# EAGLE design mastercontroller (EAGLE 5.10)
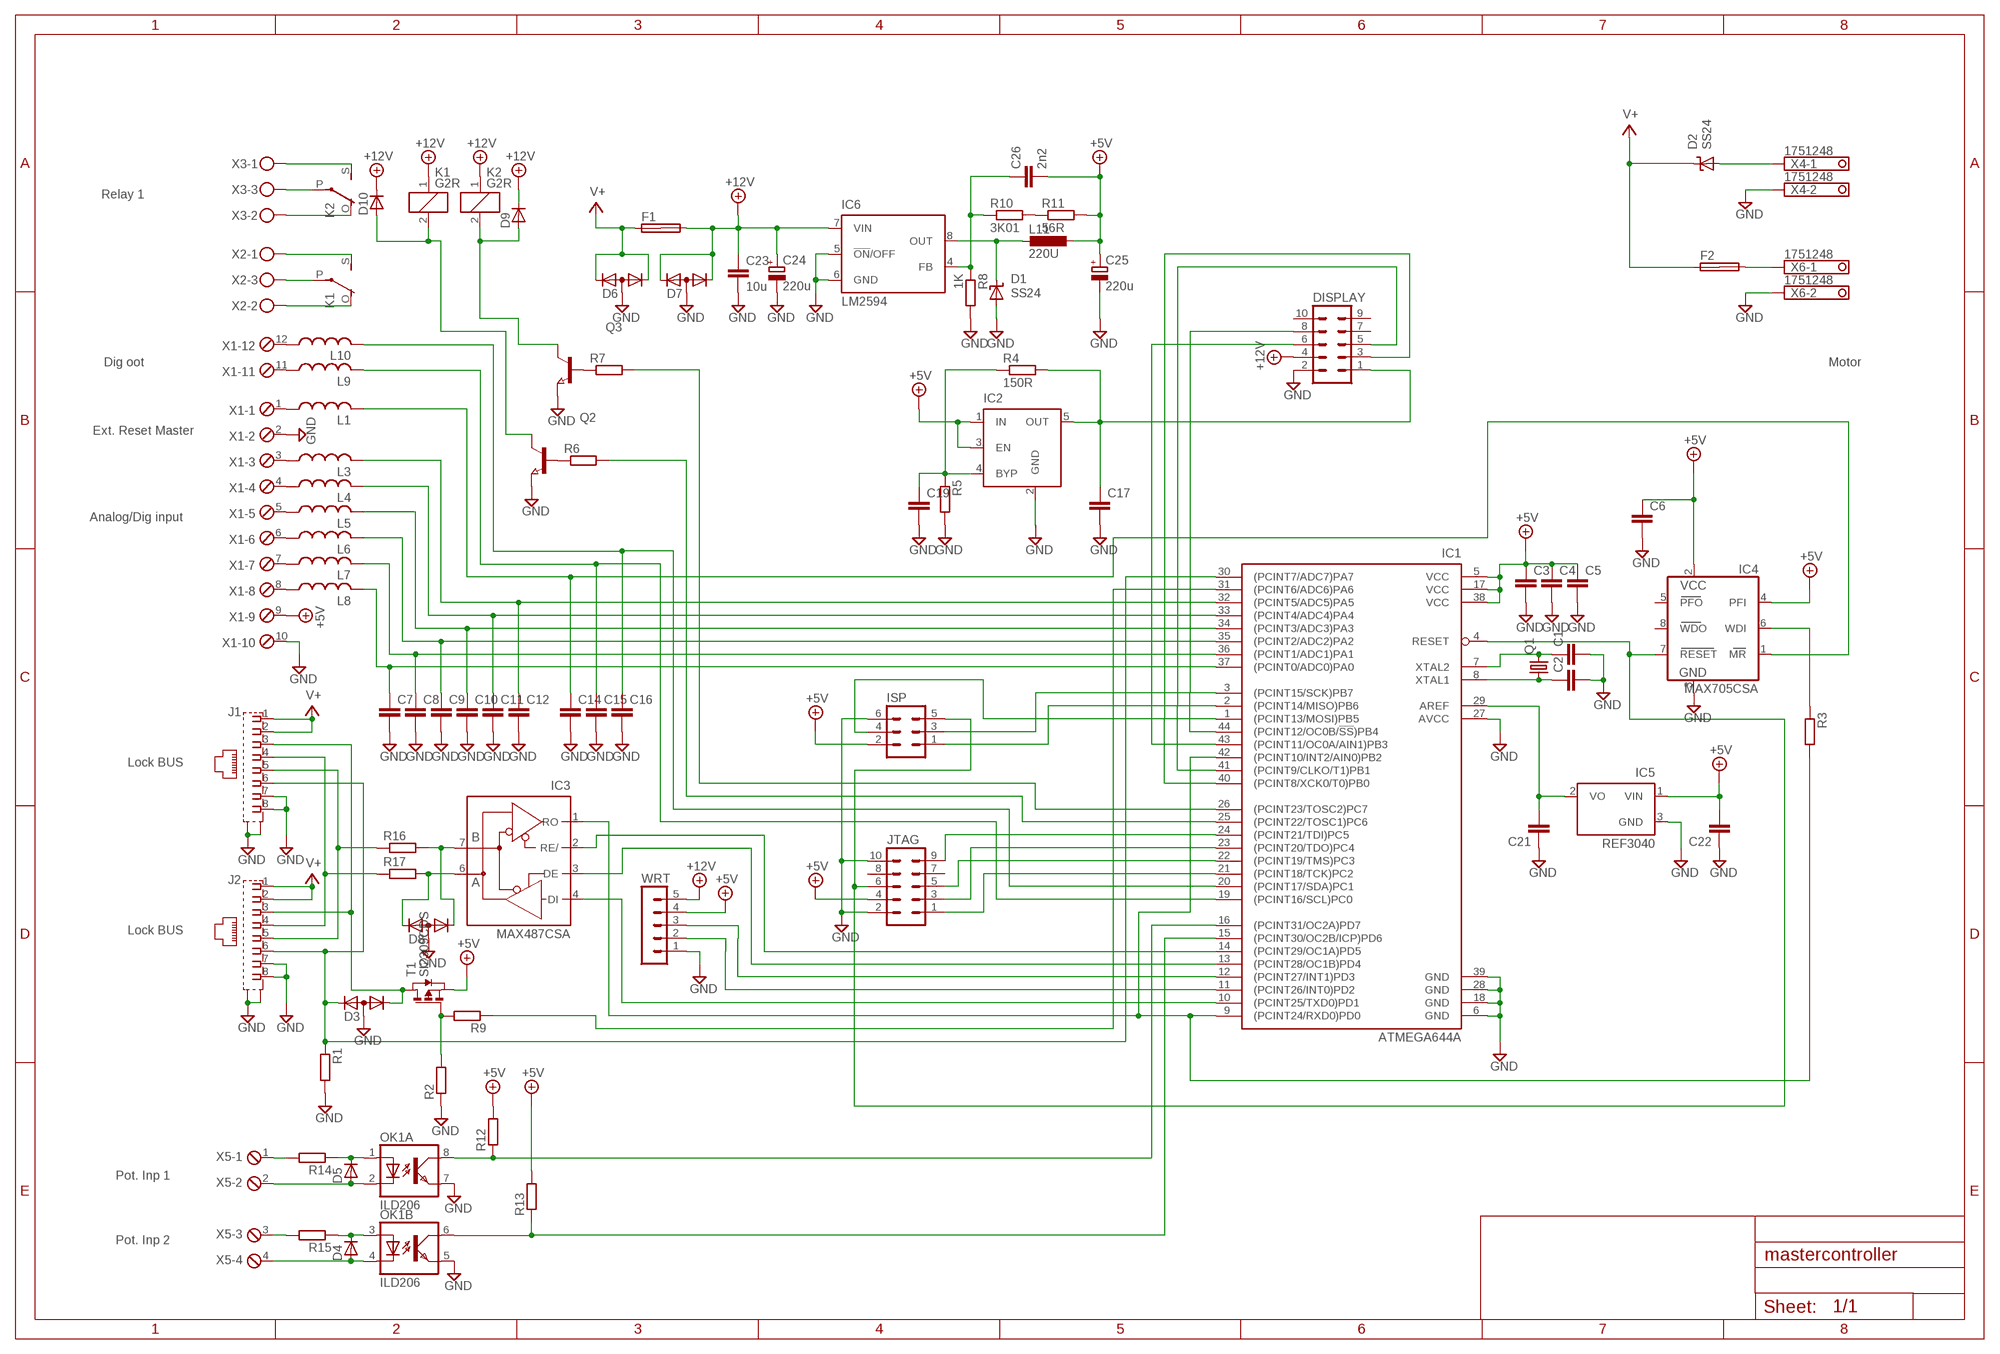
[diagram p0: schematic, sheet 1]

## Parts
C1  C-EUC0603  [C0603]
C2  C-EUC0603  [C0603]
C3  C-EUC0603  [C0603]
C4  C-EUC0603  [C0603]
C5  C-EUC0603  [C0603]
C6  C-EUC0603  [C0603]
C7  C-EUC0603  [C0603]
C8  C-EUC0603  [C0603]
C9  C-EUC0603  [C0603]
C10  C-EUC0603  [C0603]
C11  C-EUC0603  [C0603]
C12  C-EUC0603  [C0603]
C14  C-EUC0603  [C0603]
C15  C-EUC0603  [C0603]
C16  C-EUC0603  [C0603]
C17  C-EUC0603  [C0603]
C19  C-EUC0603  [C0603]
C21  C-EUC0603  [C0603]
C22  C-EUC0603  [C0603]
C23  10u  C-EUC1210  [C1210]
C24  220u  CPOL-EUE5-8.5  [E5-8,5]
C25  220u  CPOL-EUE5-8.5  [E5-8,5]
C26  2n2  C-EUC0603  [C0603]
D1  SS24  SUPPRESSOR-SMBG  [SMBG]
D2  SS24  SUPPRESSOR-SMBG  [SMBG]
D3  DIODE_CA-AC__  [SOT23C]
D4  D-MLL-34  [MELF-MLL34]
D5  D-MLL-34  [MELF-MLL34]
D6  DIODE_CA-AC__  [SOT23C]
D7  DIODE_CA-AC__  [SOT23C]
D8  DIODE_CA-AC__  [SOT23C]
D9  D-MLL-34  [MELF-MLL34]
D10  D-MLL-34  [MELF-MLL34]
DISPLAY  MA05-2  [MA05-2]
F1  SHK20L  [SHK20L]
F2  SHK20L  [SHK20L]
IC1  ATMEGA644A  [TQFP44]
IC2  MIC5219XX  [SOT23-5]
IC3  MAX487CSA  MAX481CSA  [SO08]
IC4  MAX705CSA  [SO08]
IC5  REF3040  MC1525TT  [SOT23]
IC6  LM2594  [SO08]
ISP  MA03-2  [MA03-2]
J1  555141-1  [555153-1]
J2  555141-1  [555153-1]
JTAG  MA05-2  [MA05-2]
K1  G2R  [G2R]
K2  G2R  [G2R]
L1  L-US0603  [R0603]
L3  L-US0603  [R0603]
L4  L-US0603  [R0603]
L5  L-US0603  [R0603]
L6  L-US0603  [R0603]
L7  L-US0603  [R0603]
L8  L-US0603  [R0603]
L9  L-US0603  [R0603]
L10  L-US0603  [R0603]
L11  220U  DO3316P  [DO3316P]
OK1  ILD206  [SOIC08]
Q1  CRYSTALHC49S  [HC49/S]
Q2  NPN-TRANSISTOR_SOT23  [SOT23]
Q3  NPN-TRANSISTOR_SOT23  [SOT23]
R1  R-EU_R0603  [R0603]
R2  R-EU_R0603  [R0603]
R3  R-EU_R0603  [R0603]
R4  150R  R-EU_R0603  [R0603]
R5  R-EU_R0603  [R0603]
R6  R-EU_R0603  [R0603]
R7  R-EU_R0603  [R0603]
R8  1K  R-EU_R0603  [R0603]
R9  R-EU_R0603  [R0603]
R10  3K01  R-EU_R0603  [R0603]
R11  56R  R-EU_R0603  [R0603]
R12  R-EU_R0603  [R0603]
R13  R-EU_R0603  [R0603]
R14  R-EU_R0603  [R0603]
R15  R-EU_R0603  [R0603]
R16  R-EU_R0603  [R0603]
R17  R-EU_R0603  [R0603]
T1  SI2309CDS  PMOSSOT23  [SOT-23]
WRT  MA05-1  [MA05-1]
X1  MPT12  [12POL254]
X2  MKDSN1,5/3-5,08  [MKDSN1,5/3-5,08]
X3  MKDSN1,5/3-5,08  [MKDSN1,5/3-5,08]
X4  1751248  [1751248]
X5  MPT4  [4POL254]
X6  1751248  [1751248]

## Nets
+5V: C3.1 C4.1 C5.1 C6.1 C22.2 C25.+ C26.2 IC1.5(VCC) IC1.17(VCC) IC1.38(VCC) IC2.1(IN) IC2.3(EN) IC4.2(VCC) IC4.4(PFI) IC5.1(VIN) ISP.2 JTAG.4 L11.2 R11.2 R12.2 R13.2 T1.2(S) WRT.4 X1.9
+12V: C23.1 C24.+ D7.1(K1) D7.2(K2) D9.1(C) D10.1(C) DISPLAY.4 F1.2A IC6.7(VIN) K1.1 K2.1 WRT.5
GND: C1.2 C2.2 C3.2 C4.2 C5.2 C6.2 C7.2 C8.2 C9.2 C10.2 C11.2 C12.2 C14.2 C15.2 C16.2 C17.2 C19.2 C21.1 C22.1 C23.2 C24.- C25.- D1.A D3.3(A) D6.3(A) D7.3(A) D8.3(A) DISPLAY.2 IC1.6(GND) IC1.18(GND) IC1.27(AVCC) IC1.28(GND) IC1.39(GND) IC2.2(GND) IC4.3(GND) IC5.3(GND) IC6.5(!ON!/OFF) IC6.6(GND) ISP.6 J1.7 J1.8 J1.G1(S1) J1.G2(S2) J2.7 J2.8 J2.G1(S1) J2.G2(S2) JTAG.2 JTAG.10 OK1.5(B:EMIT) OK1.7(A:EMIT) Q2.2(E) Q3.2(E) R1.2 R2.1 R5.2 R8.2 WRT.1 X1.2 X1.10 X4.2 X6.2
N$1: K2.P(2:P) X3.3
N$2: IC1.10((PCINT25/TXD0)PD1) IC3.4(DI)
N$3: IC1.13((PCINT28/OC1B)PD4) IC3.3(DE)
N$4: IC1.14((PCINT29/OC1A)PD5) IC3.2(RE/)
N$5: J1.4 J2.4 R17.1
N$6: J1.5 J2.5 R16.1
N$7: C2.1 IC1.8(XTAL1) Q1.1
N$8: C1.1 IC1.7(XTAL2) Q1.2
N$9: IC1.4(RESET) IC4.7(RESET) ISP.5 JTAG.6
N$10: L1.1 X1.1
N$12: IC1.16((PCINT31/OC2A)PD7) OK1.8(A:COL) R12.1
N$13: D3.2(K2) IC1.30((PCINT7/ADC7)PA7) J1.6 J2.6 R1.1
N$14: L3.1 X1.3
N$15: L4.1 X1.4
N$16: L5.1 X1.5
N$17: L6.1 X1.6
N$18: L7.1 X1.7
N$19: L8.1 X1.8
N$20: C7.1 IC1.37((PCINT0/ADC0)PA0) L8.2
N$21: C8.1 IC1.36((PCINT1/ADC1)PA1) L7.2
N$22: C9.1 IC1.35((PCINT2/ADC2)PA2) L6.2
N$23: C10.1 IC1.34((PCINT3/ADC3)PA3) L5.2
N$24: C11.1 IC1.33((PCINT4/ADC4)PA4) L4.2
N$25: C12.1 IC1.32((PCINT5/ADC5)PA5) L3.2
N$27: DISPLAY.6 IC1.43((PCINT11/OC0A/AIN1)PB3)
N$28: D3.1(K1) J1.3 J2.3 T1.1(D)
N$29: L9.1 X1.11
N$30: L10.1 X1.12
N$31: C15.1 IC1.19((PCINT16/SCL)PC0) L9.2
N$32: C16.1 IC1.20((PCINT17/SDA)PC1) L10.2
N$33: DISPLAY.8 IC1.44((PCINT12/OC0B/!SS!)PB4)
N$34: DISPLAY.5 IC1.41((PCINT9/CLKO/T1)PB1)
N$35: K2.O(2:O) X3.2
N$36: K1.P(2:P) X2.3
N$37: K2.S(2:S) X3.1
N$38: K1.S(2:S) X2.1
N$39: K1.O(2:O) X2.2
N$40: D8.1(K1) IC3.7(B) R16.2
N$41: DISPLAY.3 IC1.40((PCINT8/XCK0/T0)PB0)
N$42: C19.1 IC2.4(BYP) R4.1 R5.1
N$43: IC1.31((PCINT6/ADC6)PA6) R9.1
N$44: C17.1 DISPLAY.1 IC2.5(OUT) R4.2
N$45: R2.2 R9.2 T1.3(G)
N$48: D2.A X4.1
N$49: Q2.1(B) R6.1
N$50: Q3.1(B) R7.1
N$51: IC1.25((PCINT22/TOSC1)PC6) R6.2
N$52: IC1.26((PCINT23/TOSC2)PC7) R7.2
N$53: D9.2(A) K2.2 Q3.3(C)
N$54: C21.2 IC1.29(AREF) IC5.2(VO)
N$55: D10.2(A) K1.2 Q2.3(C)
N$56: IC1.11((PCINT26/INT0)PD2) WRT.2
N$57: IC4.6(WDI) R3.1
N$58: D1.C IC6.8(OUT) L11.1
N$59: IC1.12((PCINT27/INT1)PD3) WRT.3
N$60: R10.2 R11.1
N$61: C26.1 IC6.4(FB) R8.1 R10.1
N$62: IC1.21((PCINT18/TCK)PC2) JTAG.1
N$63: IC1.22((PCINT19/TMS)PC3) JTAG.5
N$64: IC1.23((PCINT20/TDO)PC4) JTAG.3
N$65: IC1.24((PCINT21/TDI)PC5) JTAG.9
N$66: C14.1 IC4.1(MR) L1.2
N$67: IC1.15((PCINT30/OC2B/ICP)PD6) OK1.6(B:COL) R13.1
N$68: R14.2 X5.1
N$69: D5.2(A) OK1.2(A:C) X5.2
N$70: D5.1(C) OK1.1(A:A) R14.1
N$71: D4.1(C) OK1.3(B:A) R15.1
N$72: D4.2(A) OK1.4(B:C) X5.4
N$73: R15.2 X5.3
N$74: IC1.3((PCINT15/SCK)PB7) ISP.3
N$75: IC1.2((PCINT14/MISO)PB6) ISP.1
N$76: F2.2A X6.1
N$77: IC1.1((PCINT13/MOSI)PB5) ISP.4
N$78: IC1.9((PCINT24/RXD0)PD0) IC1.42((PCINT10/INT2/AIN0)PB2) IC3.1(RO) R3.2
N$80: D8.2(K2) IC3.6(A) R17.2
V+: D2.C D6.1(K1) D6.2(K2) F1.1A F2.1A J1.1 J1.2 J2.1 J2.2
Unconnected: DISPLAY.7 DISPLAY.9 DISPLAY.10 F1.1B F1.2B F2.1B F2.2B IC4.5(PFO) IC4.8(WDO) JTAG.7 JTAG.8

## Notes on the sheet
- Relay 1
- Dig oot | Motor
- Ext. Reset Master
- Analog/Dig input
- Lock BUS
- Lock BUS
- Pot. Inp 1
- Pot. Inp 2

## Power pins joined to a net without a drawn wire
GND: IC3.5(GND)
VCC: IC3.8(VCC)

## Library data of the parts
C1-C12 C14-C17 C19 C21-C23 C26 = rcl:C-EU: CAPACITOR, European symbol
C24 C25 = rcl:CPOL-EU: POLARIZED CAPACITOR, European symbol
D1 D2 = diode:SUPPRESSOR-: Suppressor diode
D3 D6-D8 = semicon-smd-ipc:DIODE_CA-AC_: DUAL DIODE
D4 D5 D9 D10 = semicon-smd-ipc:D-: DIODE unfilled
DISPLAY JTAG = con-lstb:MA05-2: PIN HEADER
F1 F2 = fuse:SHK20L: FUSE HOLDER 5 x 20 mm, SH contact, SHH1 Schukat, E1073 Buerklin
IC1 = atmel:ATMEGA644: 8-bit Microcontroller with 64K Bytes In-System Programmable Flash Source: http://www.atmel.com/dyn/resources/prod_documents/doc2593.pdf
IC2 = v-reg-micrel:MIC5219XX: VOLTAGE REGULATOR
IC3 = maxim:MAX481CSA: RS485 TRANSEIVER
IC4 = maxim:MAX705CSA: WATCHDOG
IC5 = microchip:MC15*: 2.5V and 4.096V Voltage References Source: http://www.microchip.com .. 21653b.pdf
IC6 = national-semiconductor:LM2594: LM2594 0.5 A Buck Converter
ISP = con-lstb:MA03-2: PIN HEADER
J1 J2 = con-amp:555141-1: AMP connector
K1 K2 = relay:G2R: RELAY 1 x switch, Omron
L1 L3-L10 = rcl:L-US: INDUCTOR, American symbol
L11 = inductor-coilcraft:DO3316P: COILCRAFT
OK1 = optocoupler:ILD2*: Siemens ILD205/206/207/211/213/217 DUAL PHOTOTRANSISTOR SMALL OUTLINE SURFACE MOUNT OPTOCOUPLER Source: 153385-da-01-en-Optocoupler_ILD205-T.pdf
Q1 = crystal:CRYSTAL: CRYSTAL
Q2 Q3 = semicon-smd-ipc:NPN-TRANSISTOR_: NPN TRANSISTOR
R1-R17 = rcl:R-EU_: RESISTOR, European symbol
T1 = zetex:PMOSSOT23: MOS FET
WRT = con-lstb:MA05-1: PIN HEADER
X1 = con-phoenix-254:MPT12: PHOENIX CONNECTOR
X2 X3 = con-phoenix-508:MKDSN1,5/3-5,08: MKDSN 1,5/ 3-5,08 Printklemme Nennstrom: 13,5 A Nennspannung: 250 V Rastermaß: 5,08 mm Polzahl: 3 Anschlussart: Schraubanschluss Montage: Löten Anschlussrichtung Leiter/Platine: 0 ° Artikelnummer: 1729131 Source: http://eshop.phoenixcontact.com .. 1729131.pdf
X4 X6 = con-phoenix-350:1751248: MKDS 1/ 2-3,5 Printklemme Nennstrom: 10 A Bemessungsspannung: 160 V Raster: 3,5 mm Polzahl: 2 Montageart: Löten Anschlussart: Schraubanschluss Anschlussrichtung vom Leiter zur Platine: 0° Source: http://eshop.phoenixcontact.com .. 1751248.pdf
X5 = con-phoenix-254:MPT4: PHOENIX CONNECTOR

## Board
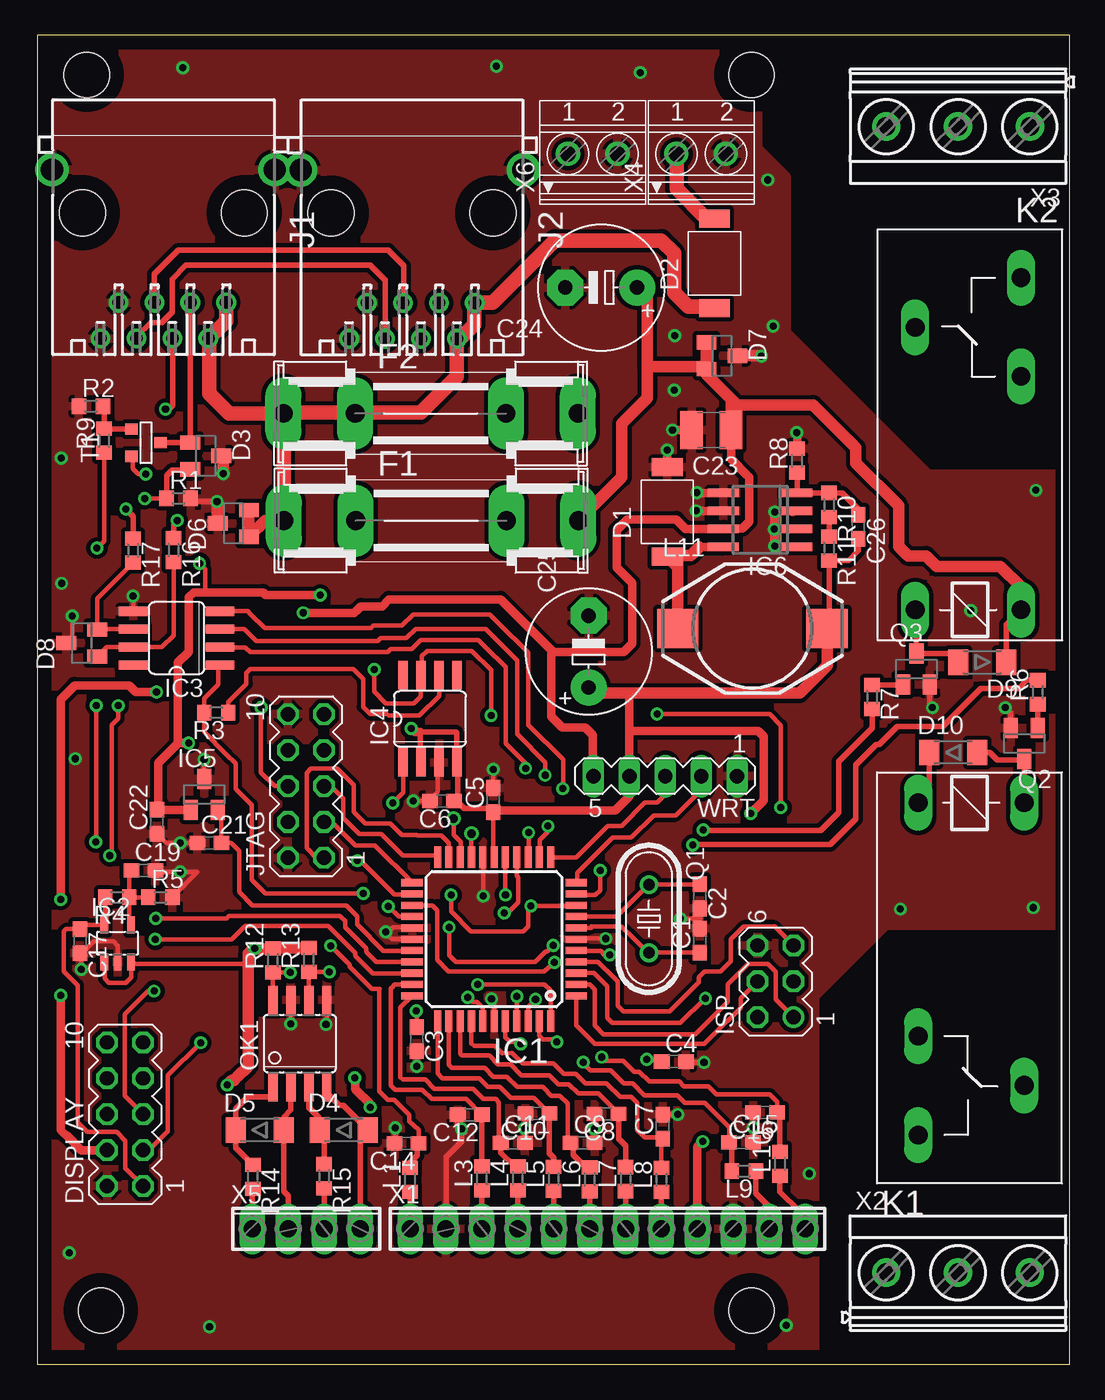
[diagram p1: board, top side]
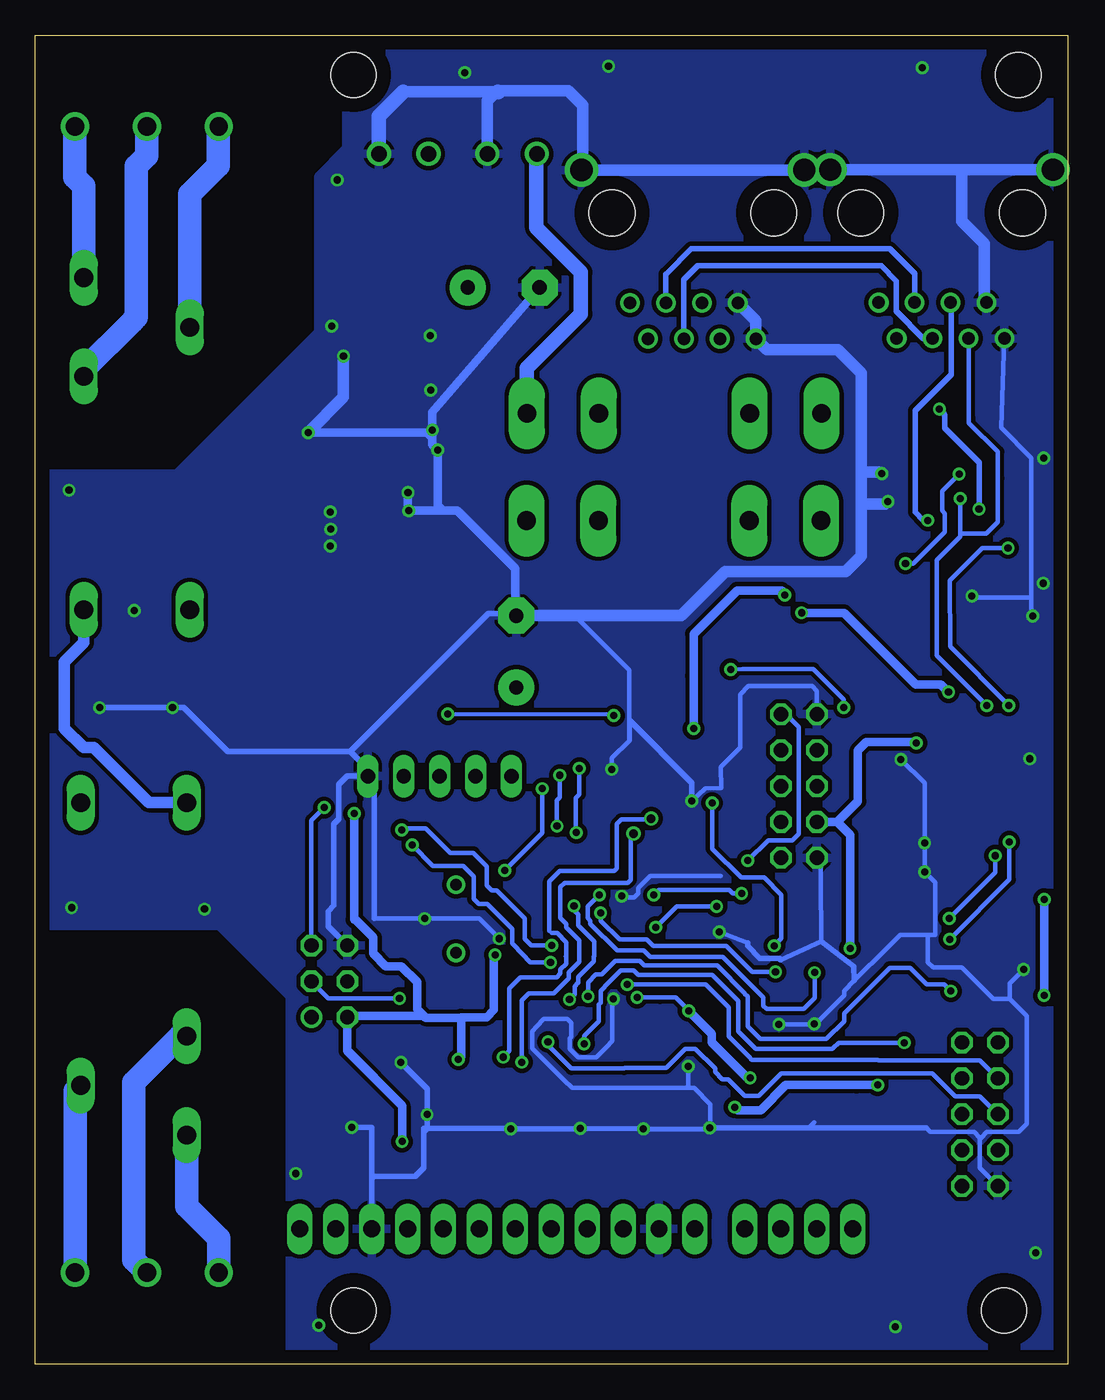
[diagram p2: board, bottom side, seen from below]

Size 73 x 94 mm. Coordinates in mm from the lower left corner, seen from the top.
Outline: 0,0 73,0 73,94 0,94 0,0
Copper layers (1*16): Top 0.035mm / dielectric 1.5mm / Bottom 0.035mm
Design rules "default": minimum track width 10mil, minimum drill 24mil, track to track 8mil, track to pad 8mil, pad to pad 8mil, via to via 8mil, smd to smd 8mil, copper to edge 40mil, drill to drill 8mil, minimum pad ring 10mil, minimum via ring 8mil, stop-mask expansion 4mil, vias tented up to drill 0mil, thermal gap 10mil
Holes 3.2 mm at 50.5,3.8 3.5,91.2 50.5,91.2 4.5,3.8

### Footprints (pad centres in the part's own frame; a part is rotated, then mirrored left to right if it is on the bottom)
C0603 = smd 1.1 x 1: 1 -0.85,0; 2 0.85,0
C1210 = smd 1.6 x 2.7: 1 -1.4,0; 2 1.4,0
E5-8,5 = drill 1.016 pad 2.54 round: + -2.54,0 | drill 1.016 pad 2.54 octagon: - 2.54,0
SMBG = smd 1.27 x 2.16: A 3.17,0; C -3.17,0
SOT23C = smd 1 x 1.4: 1 -0.95,-1.1; 2 0.95,-1.1; 3 0,1.1
MELF-MLL34 = smd 1.4 x 1.8: 1 -1.7,0; 2 1.7,0
MA05-2 = drill 1.016 octagon: 1 -5.08,-1.27; 2 -5.08,1.27; 3 -2.54,-1.27; 4 -2.54,1.27; 5 0,-1.27; 6 0,1.27; 7 2.54,-1.27; 8 2.54,1.27; 9 5.08,-1.27; 10 5.08,1.27
SHK20L = drill 1.321 pad 2.54 long: 1A -10.414,0; 1B -5.334,0; 2A 10.414,0; 2B 5.334,0
TQFP44 = smd 1.5 x 0.5: 1 -5.8,4; 2 -5.8,3.2; 3 -5.8,2.4; 4 -5.8,1.6; 5 -5.8,0.8; 6 -5.8,0; 7 -5.8,-0.8; 8 -5.8,-1.6; 9 -5.8,-2.4; 10 -5.8,-3.2; 11 -5.8,-4; 23 5.8,-4; 24 5.8,-3.2; 25 5.8,-2.4; 26 5.8,-1.6; 27 5.8,-0.8; 28 5.8,0; 29 5.8,0.8; 30 5.8,1.6; 31 5.8,2.4; 32 5.8,3.2; 33 5.8,4 | smd 0.5 x 1.5: 12 -4,-5.8; 13 -3.2,-5.8; 14 -2.4,-5.8; 15 -1.6,-5.8; 16 -0.8,-5.8; 17 0,-5.8; 18 0.8,-5.8; 19 1.6,-5.8; 20 2.4,-5.8; 21 3.2,-5.8; 22 4,-5.8; 34 4,5.8; 35 3.2,5.8; 36 2.4,5.8; 37 1.6,5.8; 38 0.8,5.8; 39 0,5.8; 40 -0.8,5.8; 41 -1.6,5.8; 42 -2.4,5.8; 43 -3.2,5.8; 44 -4,5.8
SOT23-5 = smd 0.55 x 1.2: 1 -0.95,-1.3; 2 0,-1.3; 3 0.95,-1.3; 4 0.95,1.3; 5 -0.95,1.3
SO08 = smd 0.66 x 2.032: 1 -1.905,-3.073; 2 -0.635,-3.073; 3 0.635,-3.073; 4 1.905,-3.073; 5 1.905,3.073; 6 0.635,3.073; 7 -0.635,3.073; 8 -1.905,3.073
SOT23 = smd 1 x 1.4: 1 -0.95,-1.1; 2 0.95,-1.1; 3 0,1.1
SO08' = smd 0.6 x 2.2: 1 -1.905,-2.6; 2 -0.635,-2.6; 3 0.635,-2.6; 4 1.905,-2.6; 5 1.905,2.6; 6 0.635,2.6; 7 -0.635,2.6; 8 -1.905,2.6
MA03-2 = drill 1.016 round: 1 -2.54,-1.27 | drill 1.016 octagon: 2 -2.54,1.27; 3 0,-1.27; 4 0,1.27; 5 2.54,-1.27; 6 2.54,1.27
555153-1 = drill 0.889 round: 1 -4.445,6.35; 2 -3.175,8.89; 3 -1.905,6.35; 4 -0.635,8.89; 5 0.635,6.35; 6 1.905,8.89; 7 3.175,6.35; 8 4.445,8.89 | drill 1.575 pad 2.184 round: G1 -7.874,-3.048; G2 7.874,-3.048 | hole 3.251: -5.715,0; 5.715,0
G2R = drill 1.321 long: 1 -2.54,-3.683; 2 -2.54,3.81; O 13.97,-3.683; P 17.45,3.81; S 20.955,-3.683
R0603 = smd 1 x 1.1: 1 -0.85,0; 2 0.85,0
DO3316P = smd 2.92 x 2.79: 1 -5.28,0; 2 5.28,0
SOIC08 = smd 0.66 x 2.032: 1 -1.905,-3.073; 2 -0.635,-3.073; 3 0.635,-3.073; 4 1.905,-3.073; 5 1.905,3.073; 6 0.635,3.073; 7 -0.635,3.073; 8 -1.905,3.073
HC49/S = drill 0.813 round: 1 -2.413,0; 2 2.413,0
SOT-23 = smd 0.787 x 0.889: 1 0.025,-1.016; 2 -0.94,1.016; 3 0.991,1.016
MA05-1 = drill 1.016 long: 1 -5.08,0; 2 -2.54,0; 3 0,0; 4 2.54,0; 5 5.08,0
12POL254 = drill 1.2 long: 1 -13.97,0; 2 -11.43,0; 3 -8.89,0; 4 -6.35,0; 5 -3.81,0; 6 -1.27,0; 7 1.27,0; 8 3.81,0; 9 6.35,0; 10 8.89,0; 11 11.43,0; 12 13.97,0
MKDSN1,5/3-5,08 = drill 1.3 pad 2 round: 1 -7.641,0.025; 2 -2.561,0.025; 3 2.519,0.025
1751248 = drill 1.1 pad 1.7 round: 1 -1.75,-0.1; 2 1.75,-0.1
4POL254 = drill 1.2 long: 1 -3.81,0; 2 -1.27,0; 3 1.27,0; 4 3.81,0

### Placement (x,y rotation side)
C1  46.85,29.96 90 top
C2  46.84,33.09 270 top
C3  26.82,23 270 top
C4  45.01,21.4 0 top
C5  32.24,39.91 90 top
C6  28.62,39.84 180 top
C7  44.22,16.81 90 top
C8  40.26,17.71 180 top
C9  38.55,15.65 0 top
C10  35.37,17.75 180 top
C11  33.62,15.66 0 top
C12  30.59,17.65 180 top
C14  26.11,15.62 180 top
C15  49.77,15.69 0 top
C16  51.48,17.81 180 top
C17  3.02,29.93 270 top
C19  7.5,34.93 0 top
C21  12.17,36.87 0 top
C22  8.46,38.36 90 top
C23  47.67,66.07 180 top
C24  39.88,76.16 180 top
C25  38.99,50.41 90 top
C26  58.06,59.23 270 top
D1  44.55,60.29 90 top
D2  47.9,77.87 90 top
D3  11.91,64.25 270 top
D4  21.68,16.56 0 top
D5  15.73,16.56 0 top
D6  13.87,59.48 90 top
D7  48.42,71.33 270 top
D8  3.15,51.02 90 top
D9  66.83,49.66 180 top
D10  64.78,43.27 0 top
DISPLAY  6.21,17.68 90 top
F1  27.85,59.67 0 top
F2  27.82,67.25 0 top
IC1  32.3,30.06 180 top
IC2  5.68,29.77 0 top
IC3  9.86,51.37 90 top
IC4  27.77,45.65 0 top
IC5  11.8,40.3 0 top
IC6  LM2594  [SO08']  51.12,59.73 90 top
ISP  52.21,27.08 90 top
J1  8.92,81.45 180 top
J2  26.5,81.43 180 top
JTAG  19,40.9 90 top
K1  65.98,37.17 270 top
K2  65.89,55.9 90 top
L1  26.36,13.05 90 top
L3  31.44,13.15 90 top
L4  33.98,13.14 90 top
L5  36.52,13.1 90 top
L6  39.07,13.07 90 top
L7  41.61,13.09 90 top
L8  44.14,13.05 90 top
L9  49.97,13.66 180 top
L10  52.52,14.17 90 top
L11  50.57,52.04 0 top
OK1  18.57,22.68 0 top
Q1  43.25,31.5 270 top
Q2  69.8,43.9 180 top
Q3  62.17,49.17 0 top
R1  9.99,61.24 0 top
R2  3.8,67.75 0 top
R3  12.65,46.09 180 top
R4  5.66,33.02 180 top
R5  8.71,33.02 0 top
R6  70.75,47.53 90 top
R7  59.03,47.2 270 top
R8  53.73,63.91 90 top
R9  4.73,65.33 90 top
R10  55.99,60.78 270 top
R11  55.99,57.7 270 top
R12  16.66,28.56 90 top
R13  19.21,28.59 90 top
R14  15.24,13.25 270 top
R15  20.29,13.3 270 top
R16  9.64,57.59 270 top
R17  6.79,57.56 270 top
T1  7.69,65.16 90 top
WRT  44.41,41.6 180 top
X1  40.33,9.57 0 top
X2  67.67,6.45 0 top
X3  62.55,87.57 180 top
X4  46.95,85.72 0 top
X5  19.02,9.57 0 top
X6  39.28,85.72 0 top

### Tracks (layer width: path | path; a pad name or v marks a point on that pad's centre or on a via)
+5V  (via drill 0.5)
  Top 0.305: IC1.38 31.5,25.2 31.07,25.63 30.76,25.63 v30.45,25.94 | C3.1 26.82,24.75 v26.8,25 | IC1.5 38.12,29.24 39.62,29.24 39.63,29.23 39.84,29.23 40.11,28.96 v40.49,28.96 | C4.1 44.14,21.42 v43.09,21.56 | IC1.17 32.24,35.92 C5.1 | 8.47,39.2 C22.2 | 10.84,39.22 IC5.1 | IC2.1 4.76,28.44 4.76,27.28 5.06,26.98 6.24,26.98 6.63,27.37 IC2.3 6.93,28.32 14.93,28.32 | T1.2 6.75,64.14 6.75,63.34 7.13,62.96 v7.68,62.96 | v11.47,56.64 11.87,56.24 11.87,54.6
  Top 0.406: C26.2 58.06,57.55 57.37,56.85 R11.2 55.99,52.19 L11.2 | IC4.2 27.09,42.63 27.09,44.72 29.61,44.72 29.68,44.65 IC4.4 29.72,42.54 29.72,41.06 29.73,39.86 C6.1 29.69,39.81 30.21,39.32 31.98,39.32 C5.1
  Top 0.61: 22.52,20.31 v22.46,20.25 22.5,20.21 22.5,19.45 23.55,18.4 v23.55,18.18 | v47.07,15.75 46.68,15.36 X1.9 | 39.39,47.47 39.4,47.46 41.86,47.46 41.87,47.45 41.87,44.78 | C5.1 32.35,39.17 33.18,39.17 40.72,39.17 40.88,39.17 41.87,40.16 WRT.4 41.87,44.78 | 8.47,39.2 8.57,39.3 8.57,42.53 9.98,43.94 | 10.84,39.22 10.82,39.21 C22.2 | v15.39,29.42 15.41,29.42 15.35,29.38 | 9.98,43.94 9.95,43.97 9.95,49.62 10.72,50.39 10.72,54.25 11.07,54.6 11.87,54.6 15.97,54.6 16.17,54.4 v20.01,54.4 | v26.45,44.96 26.69,44.72 27.09,44.72 | v10.7,43.94 9.98,43.94 | v50.46,38.95 51.37,39.86 51.37,44.39 50.98,44.78 41.87,44.78 | v13.44,19.75 14.01,20.32 14.15,20.32
  Top 0.813: v13.44,19.75 13.77,20.08 13.92,20.08 14.15,20.32 14.92,21.08 14.93,28.32 14.92,29.04 15.26,29.38 15.35,29.38 16.63,29.38 R12.2 16.69,29.44 R13.2 | L11.2 55.85,49.41 53.91,47.47 39.39,47.47 C25.+
  Bottom 0.305: v30.45,25.94 28.84,25.94 27.7,25.95 27.42,25.67 v26.8,25 | v7.68,62.96 8.88,61.76 8.88,60.37 8.69,60.18 8.69,58.87 10.92,56.64 v11.47,56.64
  Bottom 0.61: v22.46,20.25 22.67,20.25 25.18,22.76 25.18,23.38 v26.8,25 | v40.49,28.96 40.57,28.88 40.57,25.05 41.08,24.54 42.9,24.54 | ISP.2 50.93,22.15 47.07,18.29 | 47.07,18.29 v47.07,15.75 | v43.09,21.56 42.9,21.73 42.9,24.54 | v10.7,43.94 10.77,44.01 14.23,44.01 14.83,43.41 14.83,39.81 16.29,38.35 | 16.29,38.35 JTAG.4 | 16.29,38.35 15.38,37.45 v15.39,29.42 | v26.45,44.96 26.45,48.69 26.45,51.66 23.37,54.74 20.22,54.74 20.01,54.53 v20.01,54.4 | 42.9,24.54 42.94,24.5 45.41,24.5 45.53,24.62 | 45.53,24.62 46.01,25.1 46.01,27.04 47.12,28.15 48.21,28.15 49.1,29.04 49.1,30.18 50.34,31.42 50.43,31.42 50.46,31.45 v50.46,38.95 | 47.07,18.29 50.96,22.18 50.96,24.47 50.8,24.62 45.53,24.62 | v23.55,18.18 23.34,17.97 21.9,17.97 21.89,17.96 21.7,17.96 19.92,19.74 14.94,19.74 14.94,19.75 v13.44,19.75
+12V  (via drill 0.5)
  Top 0.406: D9.1 68.53,52.32 K2.1 | D10.1 63.08,40.49 K1.1
  Top 0.61: C23.1 49.07,64.01 50.21,62.87 50.33,62.75 50.33,59.6 49.85,59.12 48.55,59.12 IC6.7 47.62,59.09 47.61,59.09 45.87,59.09 45.2,59.76 41.73,59.76 40.97,59 40.97,56.36 42.07,55.26 42.07,50.99 41.46,50.38 37.57,50.38 36.48,50.38 | WRT.5 39.29,41.64 39.29,44.51 38.75,45.05 37.11,45.05 36.35,45.81 36.35,49.16 36.35,50.25 36.48,50.38 | 36.48,50.38 32.77,54.09 24.87,54.09 24.39,53.61 22.88,53.61 22.54,53.27 22.52,53.27 22.4,53.15 v18.82,53.15 | v8.43,47.54 6.97,47.54 6.5,48.01 2.65,48.01 2.07,47.43 1.66,47.02 v1.66,32.88 | DISPLAY.4 3.1,15.14 2.07,16.17 2.05,16.17 1.78,16.44 1.78,16.45 1.66,16.57 v1.66,26.07 v1.67,26.08
  Top 0.813: C23.1 49.07,68.27 | K2.1 69.57,54.96 68.11,56.42 63.62,56.42 62.86,57.18 61.58,57.18 60.91,57.85 60.91,60.72 57.89,63.74 57.89,64.83 54.87,67.85 49.49,67.85 49.07,68.27 | 47.21,72.39 D7.1 D7.2 | F1.2A 41.34,62.75 41.34,66.55 43.12,68.33 43.12,70.55 | D7.2 47.15,70.55 43.12,70.55 | 49.07,68.27 47.32,70.02 D7.2 | C24.+ 43.12,75.46 43.12,70.55
  Bottom 0.61: v18.82,53.15 15.8,53.15 10.74,48.09 8.98,48.09 v8.43,47.54 | v1.67,26.08 v1.67,32.87 v1.66,32.88
  Bottom 0.813: K2.1 69.57,51.04 70.94,49.67 70.94,44.98 69.57,43.61 68.86,43.61 64.99,39.74 62.33,39.74 K1.1
GND  (via drill 0.5)
  Top 0.305: OK1.7 17.93,24.07 v17.92,24.06 | OK1.5 20.48,24.09 v20.42,24.04 | IC1.39 32.3,25.66 v32.12,25.84 | C3.2 v26.82,21.07 v26.83,21.07 | IC1.6 38.15,30.1 v40.2,30.1 | v45.46,31.52 46.91,31.52 46.85,31.46 C1.2 46.85,32.28 46.86,32.29 46.86,32.25 C2.2 | IC1.28 26.48,30.08 25.06,30.08 24.64,30.5 v24.64,30.58 24.84,30.58 25.15,30.89 26.48,30.89 IC1.27 | C5.2 v32.24,42.08 | R5.2 11.3,34.83 v10.12,34.83 8.45,34.83 C19.2 | C21.1 v10.12,36.87 9.11,36.87 C22.1 | IC5.3 11.79,41.41 v11.79,42.78 | D8.3 2.47,51.44 v2.47,52.93 | IC3.5 6.77,53.28 v6.77,54.33 | IC1.18 31.54,35.83 v31.54,33.11 | IC4.3 28.31,42.48 28.31,41.26 28.31,40.52 C6.2 27.79,39.85 v26.58,39.85 | IC2.2 5.7,28.49 5.7,29.6 5.41,29.89 3.98,29.89 3.17,29.08 | 3.17,29.08 C17.2 3.17,29.08 | 3.17,29.08 3.12,29.03 v3.12,27.93
  Top 0.406: v30,16.64 30.23,16.39 | v25.31,16.71 25.31,15.66 C14.2 | C12.2 29.73,16.91 v30,16.64 | C11.2 34.48,16.62 v34.46,16.68 34.52,16.77 C10.2 | C9.2 39.41,16.63 v39.39,16.65 39.41,16.66 C8.2 | C15.2 50.62,16.66 v50.63,16.75 v50.62,16.76 C16.2 | C7.2 v45.3,17.66 | C4.2 45.92,21.34 v47.15,21.34 | Q2.2 68.85,46.05 v68.46,46.44 | Q3.2 63.12,46.62 v63.3,46.44 | R1.2 11.05,61.03 v12.71,61.03 | X1.2 28.92,9.59 28.92,14.67 30,15.75 v30,16.64
  Top 0.61: IC6.6 v46.59,60.37 | IC6.5 46.66,61.63 v46.65,61.65 | v44.55,64.67 D1.A | C23.2 44.94,66.07 v44.92,66.09 | R8.2 53.73,65.88 v53.71,65.9 | 53.43,60.29 53.43,60.34 52.12,60.34 52.12,59.08 | 52.12,59.08 v52.12,59.06 52.12,57.84 52.19,57.84 52.19,57.82 53.14,57.82 | 53.14,59.04 53.14,59.08 52.12,59.08
  Top 0.813: D7.3 51.19,71.33 v51.21,71.31 | D6.3 12.71,59.54 v12.71,61.03 | D3.3 13.15,64.11 v13.15,62.99
  Bottom 0.305: 18.31,16.71 17.92,17.1 | v20.42,24.04 17.94,24.04 v17.92,24.06 17.82,24.06 15.81,26.07 15.81,26.4 15.07,27.14 12.78,29.43 11.85,30.36 9.88,30.36 | 9.88,30.36 9.36,30.36 9.35,30.35 9.35,34.06 v10.12,34.83 v10.12,36.87 10.12,41.11 v11.79,42.78 | 26.98,19.54 26.42,19.54 25.27,18.39 25.27,16.75 v25.31,16.71 | 26.98,19.54 31.17,19.54 35.04,19.56 35.6,20.09 37.87,22.34 37.87,23.55 37.56,23.9 37.04,24.42 35.39,24.42 35.11,24.14 35.11,23.15 35.22,23.04 35.22,22.3 34.62,21.7 33.35,21.7 32.64,22.41 32.64,22.42 32.2,22.86 32.2,25.76 v32.12,25.84 | v26.83,21.07 26.83,19.69 26.98,19.54 | v40.2,30.1 41.62,31.52 v45.46,31.52 49.04,31.52 | 22.63,29.81 v24.64,30.58 | 20.3,28.61 17.43,29.92 17.45,34.33 17.45,35.53 JTAG.2 | C25.- 34.85,52.95 33.56,51.66 31.01,49.11 31.01,44.1 | v2.47,52.93 2.56,53.02 2.56,54.24 | 2.56,54.24 2.56,64.11 4.71,66.27 J1.8 | v6.77,54.33 6.68,54.24 2.56,54.24 | v31.54,33.11 31.25,33 30.66,33 30.37,33.29 30.37,33.69 29.52,34.54 24.54,34.54 | 31.01,44.1 32.24,42.87 v32.24,42.08 | JTAG.10 17.73,47.61 18.08,47.96 22.59,47.96 23.17,47.38 23.17,46.11 23.17,43.62 24.54,42.25 24.5,40.75 25.62,40.73 v26.58,39.85 | 31.01,44.1 30.98,44.13 30.98,45.52 | DISPLAY.2 6.22,13.88 6.22,15.91 6.11,16.02 | 6.11,16.02 5.71,16.42 3.47,16.42 2.88,17.01 2.88,24.63 4.1,25.85 | 4.1,25.85 5.28,25.85 7.5,28.07 9.52,28.07 9.88,28.43 9.88,30.36 | 10,16.71 9.71,16.42 6.6,16.42 6.21,16.02 6.11,16.02 | v3.12,27.93 4.1,26.95 4.1,25.85
  Bottom 0.406: 10,16.71 18.31,16.71 v25.31,16.71 25.4,16.62 v30,16.64 v34.46,16.68 34.49,16.65 v39.39,16.65 39.41,16.67 45.53,16.67 45.54,16.68 45.54,16.43 | v50.63,16.75 49.26,16.74 49.22,16.7 49.22,13.15 | 49.22,13.15 X1.10 | 45.54,16.43 45.54,13.88 46.12,13.3 49.07,13.3 49.22,13.15 | 45.54,16.43 45.3,16.67 v45.3,17.66 45.3,19.49 v47.15,21.34 | 63.06,46.44 62.49,46.44 59.38,43.33 50.72,43.33 | 63.06,46.44 v63.3,46.44 | v63.3,46.44 v68.46,46.44 | 50.72,43.33 40.96,53.09 39.13,53.09 C25.- | 63.06,46.44 v63.3,46.44 | 50.72,43.33 49.49,42.1 WRT.1 | WRT.1 49.04,41.15 49.04,31.52 | 17.43,29.92 15.14,28.14 15.07,27.14 | 30.98,45.52 26.58,41.12 v26.58,39.85 | ISP.6 52.3,30.98 52.3,32.03 51.89,32.44 51.89,38.22 51.54,38.57 51.54,40.99 50.93,41.6 WRT.1 | 20.3,28.61 20.39,28.7 21.76,28.7 22.63,29.57 22.63,29.81
  Bottom 0.61: 44.19,60.37 43.15,60.37 39.06,56.28 39.06,53.02 C25.- | 44.19,60.37 v46.59,60.37 46.65,60.43 v46.65,61.65 | 44.19,60.37 44.55,60.73 v44.55,64.67 44.92,65.04 44.92,65.54 | 44.92,65.54 v44.92,66.09 44.92,67.36 39.61,73.54 C24.- | v53.71,65.9 45.28,65.9 44.92,65.54
  Bottom 0.813: v51.21,71.31 51.21,68.4 v53.71,65.9 | J1.7 5.91,75.27 5.91,79.28 7.5,80.87 7.5,84.48 | 7.5,84.48 7.48,84.5 J1.G2 | 7.5,84.48 16.78,84.48 J1.G1 18.61,84.5 J2.G2 J2.G1 34.28,84.57 34.28,89.04 35.31,90.07 40.29,90.07 40.29,90 | 40.67,89.75 41.03,89.39 X6.2 | 40.67,89.75 40.35,90.07 | 48.73,85.65 X4.2 | J2.7 22.05,73.81 J2.8 21.27,71.76 16.27,71.76 14.61,70.1 14.61,63.1 | 14.61,60.84 14.61,57.15 15.69,56.07 24.2,56.07 27.32,52.95 C25.- | 14.61,60.84 14.61,63.1 | v12.71,61.03 12.9,60.84 14.61,60.84 | v13.15,62.99 13.26,63.1 14.61,63.1 | 47,90 40.67,90 40.67,89.75
  Bottom 1.016: 48.73,85.65 48.73,88.27 47,90 | 40.29,90 40.27,89.98
  other vias: 52.15,57.87 52.15,60.29 2.27,7.88 45.04,68.91 1.69,64.1 12.18,2.64 10.28,91.71 66.01,53.32 2.69,42.83 32.47,91.81 52.96,2.75 42.63,91.37 1.72,55.24 45.08,72.75 70.44,32.29 51.65,83.77 52.03,73.42 70.62,61.82 61.04,32.19 54.59,13.48
  pour Bottom (isolate 0.305): 0,0 55,0 55,21 55,26 60,31 73,31 73,63 63,63 53,73 53,84 51,86 51,94 0,94
  pour Top (isolate 0.305): 0,0 55,0 55,26 60,31 72,31 72,63 63,63 53,73 53,84 51,86 51,93 51,94 0,94
N$1
  Bottom 1.676: K2.P 62.08,82.76 60.05,84.79 60.05,87.53 X3.3
N$2  (via drill 0.5)
  Top 0.305: IC1.10 38.17,33.19 39.47,33.19 39.8,33.52 v39.8,34.93 | v37.15,40.71 37.18,40.74 37.18,42.76 34.71,45.23 34.71,50.34 32.61,52.44 32.01,53.04 29.87,53.04 26.57,53.04 25.77,52.24 23.76,52.24 23.6,52.08 16.07,52.08 15.11,53.04 14.88,53.27 IC3.4
  Bottom 0.305: v39.8,34.93 37.15,37.58 v37.15,40.71
N$3  (via drill 0.5)
  Top 0.305: IC1.13 35.54,35.9 35.54,37.09 36.11,37.66 v36.11,38.06 | v35.91,41.66 v35.92,41.67 35.92,42.58 33.93,44.57 33.93,49.77 32.27,51.42 | IC3.3 14.64,52 15.49,51.15 24.09,51.15 24.3,51.36 26.11,51.36 26.75,52 31.7,52 32.27,51.42 | 32.27,51.42 32.19,51.51
  Bottom 0.305: v36.11,38.06 36.14,38.09 36.14,39.87 35.91,40.1 v35.91,41.66
N$4  (via drill 0.5)
  Top 0.305: IC1.14 34.74,35.9 v34.74,37.6 | v34.53,42.15 34.55,42.17 34.55,42.49 33.12,43.92 33.12,49.3 31.71,50.71 31.19,51.23 27.13,51.23 26.48,50.58 25.01,50.58 24.8,50.37 15.06,50.37 14.72,50.71 12.95,50.71 IC3.2
  Bottom 0.305: v34.74,37.6 34.77,37.63 34.77,40.06 34.53,40.3 v34.53,42.15
N$5  (via drill 0.5)
  Top 0.406: J1.4 9.59,72.53 9.59,67.86 9.29,67.56 v9.07,67.56 | v6.27,60.48 6.79,59.97 R17.1
  Bottom 0.406: J2.4 27.16,72.56 27.16,76.71 26.17,77.7 13.2,77.7 12.12,76.62 12.12,74.48 10.2,72.56 J1.4 | 8.73,67.22 v9.07,67.56 9.07,67.5 8.7,67.13 8.7,66.21 6.27,63.78 6.27,62.11 v6.27,60.48
N$6  (via drill 0.5)
  Top 0.406: J2.5 25.92,75.14 25.92,77.71 24.82,78.81 9.98,78.81 8.29,77.11 J1.5 | v9.89,59.69 9.64,59.45 R16.1
  Bottom 0.406: J1.5 8.32,75.06 8.32,74.81 8.22,74.71 8.22,70.01 10.78,67.45 10.78,60.26 10.21,59.69 v9.89,59.69
N$7
  Top 0.305: IC1.8 40.99,31.66 Q1.1 43.27,33.94 C2.1
N$8
  Top 0.305: IC1.7 39.19,30.86 39.19,30.97 41.31,30.97 Q1.2 43.27,29.11 C1.1
N$9  (via drill 0.5)
  Top 0.305: IC1.4 39.65,28.46 40.79,27.32 40.79,27.31 41.04,27.06 41.04,25.36 41.45,24.95 44.71,24.95 46.76,27 46.76,27.35 47.19,27.78 48.33,27.78 49.03,28.48 49.03,30.03 49.79,30.79 49.96,30.96 52.14,30.96 ISP.5 | IC4.7 | v52.58,39.37 52.58,43.07 52.59,43.08 52.59,45.18 51.78,45.99 v43.83,45.99 | v15.83,46.45 15.81,46.43 15.81,41.87 16.79,40.9 JTAG.6 | v32.09,45.88 32.09,49.1 30.73,50.46 27.56,50.46 27.18,50.08 27.18,48.76 IC4.7 | v23.83,49.15 23.83,47.58 24.66,46.75 26.62,46.75 27.11,47.24 27.11,48.69 IC4.7
  Bottom 0.305: v32.09,45.88 32.27,45.95 v43.83,45.99 | v52.58,39.37 53.48,38.47 ISP.5 | v23.83,49.15 22.98,49.18 18.91,49.18 17.98,49.18 15.83,47.03 v15.83,46.45
N$10
  Top 0.406: X1.1 L1.1
N$12  (via drill 0.5)
  Top 0.305: OK1.8 R12.1 v17.89,27.71 v17.9,27.7 | v33.11,33.2 IC1.16
  Bottom 0.305: v17.9,27.7 17.9,25.91 18.67,25.14 21.29,25.14 21.51,25.36 21.51,25.94 24.39,28.82 29.52,28.82 29.97,29.27 31.86,29.27 33.75,31.16 33.75,31.37 33.94,31.56 33.94,32.12 33.94,32.37 v33.11,33.2
N$13  (via drill 0.5)
  Top 0.305: IC1.30 23.97,28.46 23.26,29.17 23.26,29.4 21.77,30.89 21.77,31.34 21.4,31.71 13.55,31.71 13.38,31.54 v8.38,31.54 | v5.13,35.97 5.28,36.12 5.28,45.23 5.72,45.67 v5.72,46.58 | v7.59,61.24 R1.1
  Top 0.406: J2.6 24.61,72.56 24.61,76.68 23.56,77.73 10.51,77.73 9.55,76.77 9.55,74.43 8.81,73.69 8.01,73.69 7.01,72.69 J1.6 | D3.2 10.75,63.24 9.54,63.24 9.14,62.84 R1.1
  Bottom 0.305: v8.38,31.54 5.13,34.79 v5.13,35.97 | v5.72,46.58 9.26,50.12 9.26,56.88 7.59,58.55 7.59,58.74 | 7.59,58.74 v7.59,61.24 | J1.6 6.98,72.53 6.98,66.94 6.98,66.58 4.94,64.54 4.94,62.67 4.93,62.66 4.93,59.58 5.77,58.74 7.59,58.74
N$14
  Top 0.406: X1.3 L3.1
N$15
  Top 0.406: X1.4 L4.1
N$16
  Top 0.406: X1.5 L5.1
N$17
  Top 0.406: L6.1 X1.6
N$18
  Top 0.406: L7.1 X1.7
N$19
  Top 0.406: X1.8 L8.1
N$20
  Top 0.305: IC1.37 30.7,22.7 30.73,22.67 30.89,22.51 32.36,22.51 32.87,22 33.55,22.01 34.34,21.28 36.49,21.28 37.22,20.55 38.09,20.55 38.76,19.88 40.25,19.88 41.23,18.9 42.02,18.9 42.44,18.48 42.44,16.55 42.95,16.04 44.15,16.04 C7.1 44.14,15.88 L8.2
N$21
  Top 0.305: IC1.36 29.91,21.95 30.03,21.83 31.95,21.83 32.57,21.21 33.47,21.21 34.24,20.44 36.22,20.44 36.85,19.81 37.6,19.81 38.25,19.16 39.66,19.16 C8.1
  Top 0.406: L7.2 41.61,15.43 41.11,15.93 C8.1
N$22
  Top 0.305: IC1.35 29.11,21.18 29.31,20.97 31.63,20.97 32.26,20.34 33.2,20.34 33.94,19.6 35.73,19.6 35.8,19.53 35.82,19.53 36.36,18.99 36.95,18.99 37.5,18.44 37.5,15.86 C9.1
  Top 0.406: L6.2 38.79,13.92 37.9,14.81 37.9,15.46 C9.1
N$23
  Top 0.305: IC1.34 28.3,20.55 28.63,20.23 31.26,20.23 31.87,19.62 32.7,19.62 33.47,18.85 35.12,18.85 C10.1
  Top 0.406: L5.2 36.52,14.6 36.21,14.91 C10.1
N$24
  Top 0.305: C11.1 32.65,15.79 32.65,18.52 32.41,18.76 31.54,18.76 30.83,19.47 28.09,19.47 27.42,20.14 25.84,20.14 25.68,20.3 25.68,25.23 IC1.33
  Top 0.406: L4.2 33.76,13.99 32.79,14.96 32.79,15.68 C11.1
N$25
  Top 0.305: C12.1 30.34,18.75 27.88,18.75 27.22,19.41 25.33,19.41 25.01,19.73 25.01,26.58 25.06,26.63 25.29,26.86 IC1.32
  Top 0.406: L3.2 C12.1
N$27  (via drill 0.5)
  Top 0.305: IC1.43 35.51,23.2 35.75,22.96 36.59,22.96 v36.75,22.8
  Bottom 0.305: DISPLAY.6 6.21,18.94 7.94,18.94 9.58,20.58 20.25,20.58 21.07,19.76 21.84,18.99 22.83,18.99 24,20.16 24.41,20.16 24.91,20.66 24.91,20.91 26.32,22.32 27.04,22.32 28.4,20.96 31.32,20.96 31.37,20.91 35.09,20.91 36.75,22.57 v36.75,22.8
N$28
  Top 0.406: J1.3 10.83,67.1 10.81,67.08 D3.1 T1.1
  Bottom 0.406: J2.3 28.41,77.11 28.33,77.19 26.62,78.9 12.57,78.9 10.82,77.16 J1.3
N$29
  Top 0.406: L9.1 50.82,12.08 51.74,11.16 51.74,9.59 X1.11
N$30
  Top 0.406: L10.1 52.52,12.2 53.89,10.83 53.89,9.98 X1.12
N$31  (via drill 0.5, 0.6)
  Top 0.305: C15.1 48.92,16.74 47.19,18.48 45.79,18.48 45.26,19.01 42.94,19.01 42.1,19.85 41.49,19.85 40.57,20.77 39.12,20.77 38.53,21.36 v38.6,21.37 v38.6,21.36 | v30.7,37.54 IC1.19
  Top 0.406: L9.2 49.12,15.49 C15.1
  Bottom 0.305: v30.7,37.54 30.9,37.34 30.9,34.27 31.12,34.05 35.57,34.05 35.87,33.75 35.89,33.73 35.89,31.56 35.61,31.28 35.46,31.13 35.46,30.88 34.55,29.97 34.55,28.83 34.55,28.46 35.29,27.72 35.29,27.3 36.35,26.24 38.1,26.24 38.6,25.74 38.6,22.19 v38.6,21.36
N$32  (via drill 0.5, 0.6)
  Top 0.305: C16.1 52.33,18.55 51.8,19.07 48.03,19.07 47.44,19.66 45.73,19.66 45.4,19.99 43.28,19.99 42.58,20.69 42.21,20.69 41.43,21.47 40.17,21.47 v39.92,21.72 | v29.45,38.6 29.45,37.45 29.95,36.95 29.95,35.91 IC1.20
  Top 0.406: L10.2 52.52,17.62 C16.1
  Bottom 0.305: v29.45,38.6 29.53,38.52 31.57,38.52 31.88,38.21 31.88,35.08 32.08,34.88 35.93,34.88 36.66,34.15 36.66,31.4 36.66,30.65 36.5,30.49 36.11,30.49 35.47,29.85 35.47,28.83 | 35.47,28.83 35.47,28.32 35.88,27.91 35.88,27.63 36.14,27.37 36.57,27.37 38.7,27.37 39.48,26.59 39.48,22.16 v39.92,21.72 | 35.47,28.83 35.48,28.84
N$33  (via drill 0.5)
  Top 0.305: IC1.44 36.3,26.43 35.86,26.87 31.17,26.87 v31.15,26.85
  Bottom 0.305: v31.15,26.85 25.6,26.85 23.98,25.23 23.98,23.86 23.98,23.19 22.52,21.73 22.33,21.54 13.43,21.54 13.39,21.5 13.23,21.5 10.14,21.5 6.22,21.5 DISPLAY.8
N$34  (via drill 0.5)
  Top 0.305: IC1.41 33.91,26 v33.92,26.02 | DISPLAY.5 6.19,18.97 6.19,24.73 7.85,26.39 v8.26,26.39
  Bottom 0.305: v33.92,26.02 33.92,27.02 33.38,27.56 32.94,27.56 32.12,28.38 31.98,28.52 30.26,28.52 29.94,28.2 24.79,28.2 22.82,26.23 22.82,26.19 22.63,26 22.63,23.89 21.74,23 17.07,23 15.81,24.26 15.81,24.82 12.59,28.04 11.15,28.04 9.97,26.86 8.73,26.86 v8.26,26.39
N$35
  Bottom 1.676: K2.O 69.57,70.34 66.15,73.76 65.85,74.06 65.85,84.75 65.11,85.49 X3.2
N$36
  Bottom 1.676: X2.3 70.19,19.32 K1.P
N$37
  Bottom 1.676: K2.S 69.57,83.32 70.2,83.95 X3.1
N$38
  Bottom 1.676: K1.S 62.3,11.18 60.04,8.92 X2.1
N$39
  Bottom 1.676: K1.O 62.78,23.2 66.03,19.95 66.03,7.4 X2.2
N$40
  Top 0.305: D8.1 4.91,50.73 IC3.7 8.82,50.73 9.64,51.55 R16.2
N$41  (via drill 0.5)
  Top 0.305: IC1.40 33.1,23.11 33.43,22.79 34.07,22.79 v34.2,22.66 | DISPLAY.3 7.9,15.14 9.24,16.48 9.24,20.43 v11.55,22.74
  Bottom 0.305: v34.2,22.66 34.2,23.21 33.15,24.26 33.15,25.44 33.03,25.56 33.03,26.41 32.45,26.99 31.59,27.85 30.67,27.85 30.36,27.54 25.14,27.54 23.31,25.71 23.31,23.55 22.05,22.29 16.65,22.29 16.57,22.38 16.2,22.74 v11.55,22.74
N$42
  Top 0.305: IC2.4 6.51,31.19 R4.1 | R4.1 R5.1 | C19.1 6.51,34.79 R4.1
N$43  (via drill 0.5)
  Top 0.305: IC1.31 26.48,27.64 23.73,27.64 22.48,28.89 22.48,29.09 20.58,30.99 18.61,30.99 14.69,30.99 13.76,30.06 v8.35,30.06 | v4.13,36.95 4.17,36.99 v4.17,46.6 | v4.22,57.73 4.73,58.24 R9.1
  Bottom 0.305: v8.35,30.06 4.13,34.28 v4.13,36.95 | v4.17,46.6 8.3,50.77 8.33,55.44 6.04,57.73 v4.22,57.73
N$44
  Top 0.305: R4.2 4.81,31.15 IC2.5 3.31,31.07 C17.1 2.05,30.78 1.89,30.62 1.89,27.77 2.86,26.8 2.86,17.11 3.55,16.42 5.61,16.42 6.23,15.8 6.23,13.85 DISPLAY.1
N$45
  Top 0.406: T1.3 4.76,66.15 R9.2 4.73,67.67 R2.2
N$48
  Top 1.016: X4.1 45.21,83.14 47.31,81.04 D2.A
N$49
  Top 0.406: Q2.1 R6.1
N$50
  Top 0.406: R7.1 61.2,48.05 Q3.1
N$51  (via drill 0.5)
  Top 0.305: v36.57,28.41 35.86,27.8 29.08,27.8 28.28,28.6 28.28,32.11 27.93,32.46 IC1.25
  Top 0.406: R6.2 69.97,48.38 69.39,47.8 66.73,47.8 64.04,45.11 60.83,45.11 59.55,43.83 59.33,43.83 57.88,42.38 57.88,38.58 56.07,36.77 46.4,36.77 v46.35,36.72
  Bottom 0.305: v46.35,36.72 44.89,35.26 42.75,35.26 42,34.51 42,32.91 41.66,32.57 41.05,32.57 39.27,30.79 39.27,29.75 39.16,29.64 38.01,28.41 v36.57,28.41
N$52  (via drill 0.5)
  Top 0.305: v36.49,29.62 36.08,29.21 35.95,29.21 35.2,28.46 29.59,28.46 29.12,28.93 v29.12,30.91 | v24.83,32.38 25.55,31.66 IC1.26
  Top 0.406: R7.2 59.03,44.99 56.69,42.65 56.69,39.03 55.41,37.75 47.15,37.75 v47.1,37.8
  Bottom 0.305: v47.1,37.8 46.99,37.91 45.4,37.91 43.66,36.17 42.03,36.17 41.08,35.22 41.08,33.86 40.74,33.52 40.37,33.52 38.38,31.53 38.38,30.08 38.34,30.04 37.92,29.62 v36.49,29.62 | v29.12,30.91 27.65,32.38 v24.83,32.38
N$53
  Top 0.406: K2.2 62.17,53.27 Q3.3 64.52,50.27 D9.2
N$54
  Top 0.305: IC1.29 26.48,29.24 24.47,29.24 22.61,31.1 22.61,31.69 21.84,32.46 18.55,32.46 15.22,32.46 14.27,33.41 14.27,36.31 13.71,36.87 C21.2 13.02,38.94 IC5.2
N$55
  Top 0.406: K1.2 Q2.3 69.73,42.73 67.9,42.73 67.36,43.27 D10.2
N$56
  Top 0.305: IC1.11 38.18,34.13 38.18,34.75 40.69,37.26 42.02,37.26 43.59,38.83 45.15,38.83 46.95,40.63 WRT.2
N$57
  Top 0.305: IC4.6 28.41,47.28 27,45.87 24.86,45.87 24.73,46 23.54,46 23.05,46.49 23.05,48.32 23.05,48.48 22.35,49.18 15.06,49.18 14.78,48.9 14.78,48.13 13.5,46.85 R3.1
N$58
  Top 0.61: 46.8,57.81 48.51,57.81 IC6.8
  Top 0.813: L11.1 45.29,56.38 | 45.29,56.38 D1.C | 45.29,56.38 45.29,57.11 45.19,57.21 46.2,57.21 46.8,57.81
N$59
  Top 0.305: IC1.12 38.1,35.86 40.33,38.09 41.33,38.09 42.97,39.73 43.85,39.73 44.41,40.29 WRT.3
N$60
  Top 0.406: R10.2 R11.1
N$61
  Top 0.406: C26.1 58.06,60.48 56.92,61.63 R10.1 IC6.4 R8.1
N$62
  Top 0.305: IC1.21 29.11,36.87 28.58,37.4 26.87,37.4 26.85,37.42 25.78,37.42 24.96,38.24 23.2,38.24 22.37,39.07 22.37,40.97 21.2,42.14 19.35,42.14 19.04,41.83 19.04,36.5 19.73,35.81 JTAG.1
N$63
  Top 0.305: IC1.22 28.18,35.98 25.83,35.98 24.31,37.5 22.78,37.5 21.64,38.64 21.64,40.02 20.77,40.9 JTAG.5
N$64
  Top 0.305: IC1.23 23.88,36.69 22.5,36.69 20.84,38.35 JTAG.3
N$65  (via drill 0.5)
  Top 0.305: IC1.24 26.46,33.22 25.23,33.22 22.83,35.62 v22.63,35.62
  Bottom 0.305: v22.63,35.62 21.19,37.06 19.48,37.06 19.02,37.52 19.02,45.07 19.93,45.98 JTAG.9
N$66  (via drill 0.5)
  Top 0.305: C14.1 26.96,16.57 26.32,17.19 26.3,17.65 25.25,18.7 24.79,18.7 24.2,19.29 24.2,26.54 | 24.2,26.54 24.21,26.55 | v25.14,39.7 25.87,40.43 IC4.1 | v20.74,29.6 22.11,28.23 22.11,28.09 23.66,26.54 24.2,26.54
  Top 0.406: L1.2 26.36,14.27 26.87,14.78 26.87,15.53 C14.1
  Bottom 0.305: v20.74,29.6 20.27,30.13 20.26,33.21 21.47,34.42 23.1,34.42 25.14,36.46 v25.14,39.7
N$67  (via drill 0.5)
  Top 0.305: OK1.6 R13.1 v20.65,27.74 v20.66,27.75 | v33.03,31.93 33.28,31.93 34.01,32.66 34.01,34.42 33.9,34.53 IC1.15
  Bottom 0.305: v20.66,27.75 22.29,27.75 24.14,29.6 29.32,29.6 29.71,29.99 29.75,30.03 31.69,30.03 33.03,31.37 v33.03,31.93
N$68
  Top 0.406: X5.1 15.21,12.37 R14.2
N$69
  Top 0.406: X5.2 17.75,11.9 17.43,12.22 D5.2 17.45,16.58 17.45,17.5 17.93,17.98 OK1.2
N$70
  Top 0.406: R14.1 14.03,15.31 D5.1 14.05,16.58 14.05,18.05 14.9,18.9 16.65,18.9 16.66,18.91 OK1.1
N$71
  Top 0.406: OK1.3 19.2,18.14 19.3,18.05 19.9,17.45 19.9,16.64 D4.1 20.29,16.25 R15.1
N$72
  Top 0.406: X5.4 22.83,16.01 D4.2 21.64,18.3 21.35,18.3 20.48,19.18 OK1.4
N$73
  Top 0.406: X5.3 R15.2
N$74  (via drill 0.5)
  Top 0.305: IC1.3 39.36,27.66 40.31,26.71 40.31,24.49 40.67,24.13 45.48,24.13 v47.25,25.88
  Bottom 0.305: v47.25,25.88 52.3,25.88 ISP.3
N$75
  Top 0.305: IC1.2 39.07,26.86 39.41,26.52 39.41,23.98 39.78,23.61 39.78,23.57 40.01,23.34 45.85,23.34 46.53,23.34 48.82,25.63 48.82,26.31 48.82,26.86 50.28,28.32 51.67,28.32 52.23,27.76 52.23,25.79 ISP.1
N$76
  Bottom 1.016: X6.1 37.57,85.58 37.57,80.39 34.42,77.24 34.42,74.28 38.23,70.47 F2.2A
N$77
  Top 0.305: IC1.1 38.1,23.95 39.41,22.65 46.27,22.65 47.16,22.65 48.8,24.29 48.82,24.29 49.75,25.22 49.75,25.89 ISP.4
N$78  (via drill 0.5)
  Top 0.305: IC1.42 34.7,25.29 v35.23,25.81 | IC1.9 38.06,32.42 v34.91,32.42 34.71,32.22 34.71,30.96 34.37,30.62 30.66,30.62 29.26,32.02 v29.26,33.19 | v23.06,33.29 16.13,33.29 15.15,34.27 15.15,39.57 14.03,40.69 14.03,42.48 13.37,43.14 11.8,44.71 R3.2 11.8,47.1 12.79,48.09 12.79,49.32 12.87,49.4 IC3.1
  Bottom 0.305: v35.23,25.81 34.87,26.17 34.87,26.73 34.64,26.96 34.6,26.96 34.61,26.97 34.61,27.39 33.5,28.5 33.5,28.83 33.49,28.84 33.49,29.91 34.62,31.04 34.62,31.8 34.91,32.09 v34.91,32.42 | v29.26,33.19 28.92,33.53 23.94,33.53 23.7,33.29 v23.06,33.29
N$80
  Top 0.305: IC3.6 4.28,52 D8.2 4.25,54.17 R17.2
V+
  Top 0.813: D6.2 D6.1 16.11,59.67 F1.1A | F1.1A 17.46,61.08 | F1.1A 17.48,61.92
  Top 1.016: F2.1A 17.44,67.22 F1.1A | F2.1A 13.56,67.25 12.17,68.64 12.17,72.48 J1.2 12.14,72.56 13.37,73.79 J1.1 | D2.C 47.78,74.82 46.03,74.82 45.04,75.81 45.04,78.59 44.14,79.49 36.61,79.49 32.2,75.08 J2.1 30.9,75.03 30.9,73.54 29.9,72.54 J2.2 29.68,69.88 27.11,67.31 17.47,67.31 F2.1A